# Altium schematic sheet Power.SchDoc
size A
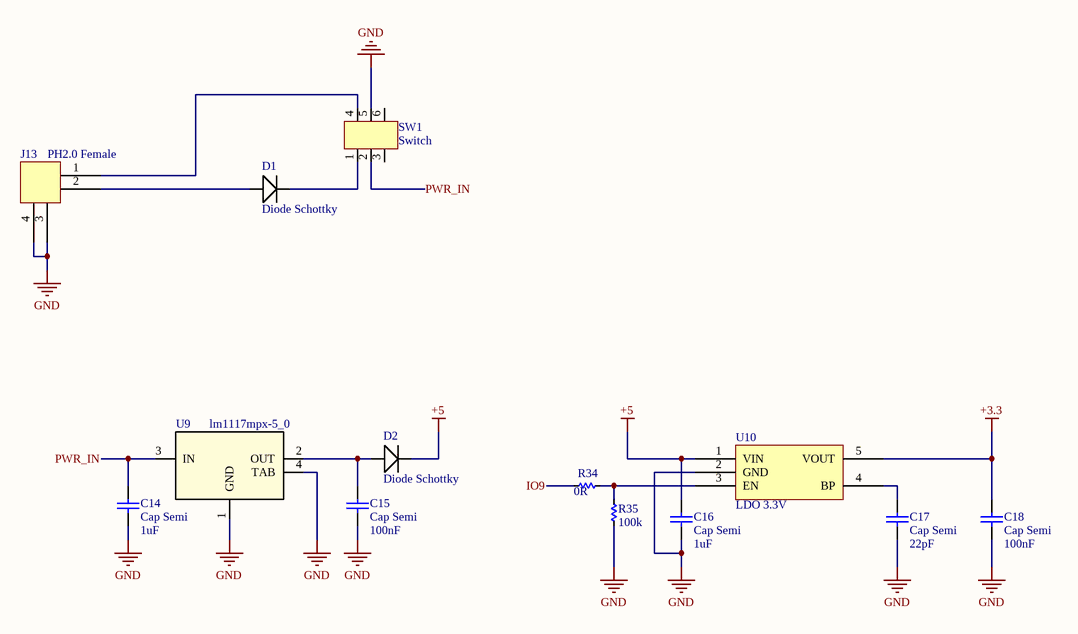
[diagram p0: Power.SchDoc]

## Parts
C14  Cap Semi  value 1uF  [1608[0603]]
C15  Cap Semi  value 100nF  [1608[0603]]
C16  Cap Semi  value 1uF  [1608[0603]]
C17  Cap Semi  value 22pF  [1608[0603]]
C18  Cap Semi  value 100nF  [1608[0603]]
D1  Diode Schottky  [DO-214AC]
D2  Diode Schottky  [DO-214AC]
J13  PH2.0 Female  [PH2.0 FEMALE]
R34  value 0R  [RES-SMD-0603]  (hidden comment: Res)
R35  value 100k  [RES-SMD-0603]  (hidden comment: Res)
SW1  Switch  [MSS-22D18]
U9  lm1117mpx-5_0  [LM1117]
U10  LDO 3.3V  [SOT-23-5]

## Nets
+3.3: C18.2 U10.5(VOUT)
+5: C16.2 D2.1(K) U10.1(VIN)
GND: C14.1 C15.1 C16.1 C17.1 C18.1 J13.3(Pin_3) J13.4(Pin_4) R35.2 SW1.5(Pin_5) U9.1(GND) U9.4(TAB) U10.2(GND)
IO9: R34.2
PWR_IN: C14.2 SW1.2(Pin_2) U9.3(IN)
NetC15_2: C15.2 D2.2(A) U9.2(OUT)
NetC17_2: C17.2 U10.4(BP)
NetD1_1: D1.1(K) SW1.1(Pin_1)
NetD1_2: D1.2(A) J13.2(Pin_2)
NetJ13_1: J13.1(Pin_1) SW1.4(Pin_4)
NetR34_1: R34.1 R35.1 U10.3(EN)

Not connected (* = marked no-connect by the designer): SW1 3(Pin_3) 6(Pin_6)

## Library data of the parts
C14-C18 = Cap Semi: Capacitor (Semiconductor SIM Model); Published: 8-Jun-2000; LatestRevisionDate: 29-May-2009; LatestRevisionNote: IPC-7351 Footprint Added.; PackageReference: C1206; Publisher: Altium Limited; PackageDescription: Chip Capacitor
D1 D2 = SS54 SMA: Diode Shotky SS54 5A 40V; Value: SS54 SMA
J13 = PH2.0: 2 Header PH 0.079"(2.00mm) Male Pin SMD,P=2mm Wire To Board / Wire To Wire Connector ROHS
R34 R35 = Res-SMD: Resistor; Manufacturer: Generic Components; Class: Passive; Published: 08/06/2000; Publisher: Altium Hobart Technology Centre
SW1 = MSS-22D18: Plugin,9.1x3.5mm Slide Switches ROHS
U9 = lm1117mpx-5_0: No Description Available; Vendor: Texas Instruments; Built_By: EMA_UL_Team; Manufacturer_Part_Number: lm1117mpx-5_0; Copyright: Copyright (C) 2018 Accelerated Designs. All rights reserved; RefDes: RefDes; Type: DEV; Value: Value
U10 = RT9193-33GB: 300mA Fixed 3.3V SOT-23-5 Linear Voltage Regulators (LDO) ROHS